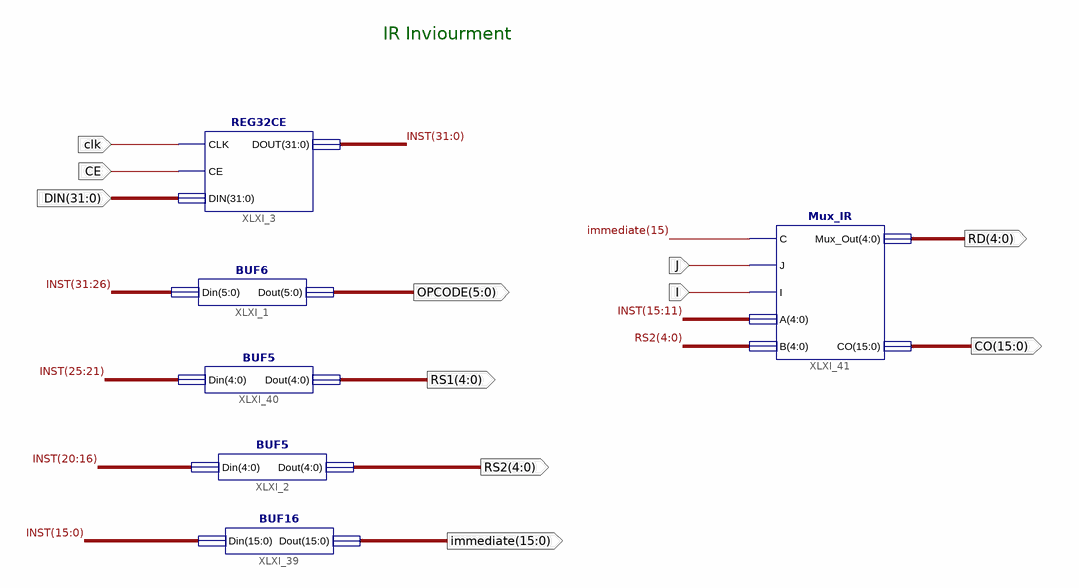
[diagram p0: schematic sheet 1]
// Xilinx ISE schematic IR7.sch (spartan6) as structural Verilog: 6 symbols, 11 ports
module IR7 (
  input  clk,
  input  CE,
  input  [31:0] DIN,
  input  J,
  input  I,
  output [5:0] OPCODE,
  output [4:0] RS1,
  output [4:0] RS2,
  output [4:0] RD,
  output [15:0] CO,
  output [15:0] immediate
);

  wire [31:0] INST;

  REG32CE XLXI_3 (.CLK(clk), .CE(CE), .DIN(DIN), .DOUT(INST));
  BUF6 XLXI_1 (.Din(INST[31:26]), .Dout(OPCODE));
  BUF5 XLXI_40 (.Din(INST[25:21]), .Dout(RS1));
  BUF5 XLXI_2 (.Din(INST[20:16]), .Dout(RS2));
  BUF16 XLXI_39 (.Din(INST[15:0]), .Dout(immediate));
  Mux_IR XLXI_41 (.C(immediate[15]), .J(J), .I(I), .A(INST[15:11]), .B(RS2), .Mux_Out(RD), .CO(CO));

  // Notes on the sheet:
  //   IR Inviourment
endmodule
